# Altium schematic sheet Current_Limit.SchDoc: LCL and inrush current limiter
size A4; Author: Grzegorz Gajoch; DocumentNumber: 8; SheetNumber: 8; SheetTotal: 16; Model: EM1; PageSetup: Record=PageOptions|CenterHorizontal=True|CenterVertical=True|PrintScale=0.52|XCorrection=1.00|YCorrection=1.00|PrintKind=1|BorderSize=5000000|LeftOffset=0|BottomOffset=0|Orientation=2|PaperLength=4200|PaperWidth=2970|Scale=100|PaperSource=7|PrintQuality=600|MediaType=1|DitherType=10|PaperKind=A3|PrintScaleMode=1; Res: 180R
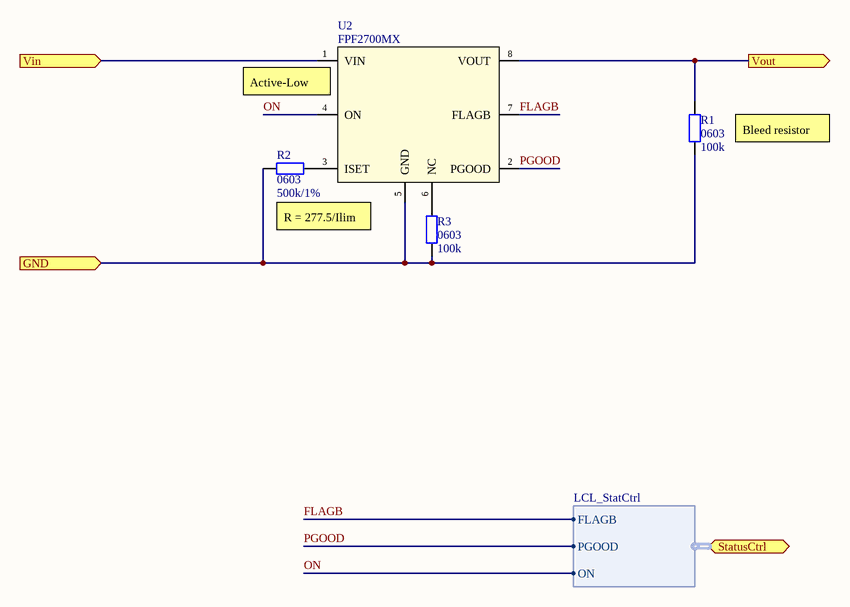
[diagram p0: Current_Limit.SchDoc]

## Parts
R1  0603  value 100k  [SMD_Resistor_0603]
R2  0603  value 500k/1%  [SMD_Resistor_0603]
R3  0603  value 100k  [SMD_Resistor_0603]
U2  FPF2700MX  [SOIC-8-N]

## Ports
GND (in), StatusCtrl (harness LCL_StatCtrl), Vin (in), Vout (out)

## Harnesses
LCL_StatCtrl: FLAGB, PGOOD, ON

## Nets
FLAGB: U2.7(FLAGB) ; port StatusCtrl.FLAGB
GND: R1.2 R2.1 R3.2 U2.5(GND) ; port GND
ON: U2.4(ON) ; port StatusCtrl.ON
PGOOD: U2.2(PGOOD) ; port StatusCtrl.PGOOD
Vin: U2.1(VIN) ; port Vin
Vout: R1.1 U2.8(VOUT) ; port Vout
NetR2_2: R2.2 U2.3(ISET)
NetR3_1: R3.1 U2.6(NC)

## Notes on the sheet
- (near U2) Active-Low
- (near R1) Bleed resistor
- R = 277.5/Ilim
- Title:
- Sheet:
- of
- Author:
- Model:
- Document Number:
- Checked by:
- Iss-Rev:
- Approved by:
- Date:
- File name:

## Library data of the parts
R1-R3 = Res2: Resistor; Published: 8-Jun-2000; LatestRevisionDate: 17-Jul-2002; LatestRevisionNote: Re-released for DXP Platform.; PackageReference: AXIAL-0.4; Publisher: Altium Limited; PackageDescription: Axial Device, Thru-Hole; 2 Leads; 0.4 in Pin Spacing
U2 = FPF2700MX: Adj over-current protection 0.4-2A, Load Switch; Manufacturer: Fairchild Semiconductor; Value: FPF2700MX